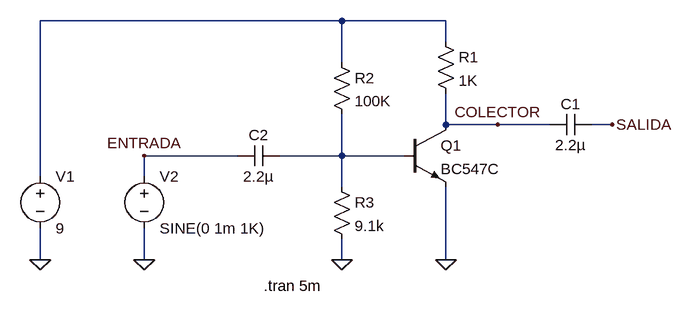
[diagram p0: schematic transistor-amplificador-1-etapa.asc]
transistor-amplificador-1-etapa.asc, the LTspice schematic file:
Version 4
SHEET 1 880 680
WIRE 208 -64 -256 -64
WIRE 368 -64 208 -64
WIRE 368 -32 368 -64
WIRE 208 0 208 -64
WIRE 368 96 368 48
WIRE 448 96 368 96
WIRE 528 96 448 96
WIRE 624 96 592 96
WIRE 48 144 -96 144
WIRE 208 144 208 80
WIRE 208 144 112 144
WIRE 304 144 208 144
WIRE -256 176 -256 -64
WIRE -96 176 -96 144
WIRE 208 192 208 144
WIRE -256 304 -256 256
WIRE -96 304 -96 256
WIRE 208 304 208 272
WIRE 368 304 368 192
FLAG -96 304 0
FLAG 368 304 0
FLAG -256 304 0
FLAG 624 96 SALIDA
FLAG -96 144 ENTRADA
FLAG 208 304 0
FLAG 448 96 COLECTOR
SYMBOL npn 304 96 R0
SYMATTR InstName Q1
SYMATTR Value BC547C
SYMBOL res 352 -48 R0
SYMATTR InstName R1
SYMATTR Value 1K
SYMBOL voltage -256 160 R0
WINDOW 123 0 0 Left 0
WINDOW 39 0 0 Left 0
SYMATTR InstName V1
SYMATTR Value 9
SYMBOL voltage -96 160 R0
WINDOW 123 0 0 Left 0
WINDOW 39 0 0 Left 0
SYMATTR InstName V2
SYMATTR Value SINE(0 1m 1K)
SYMBOL cap 592 80 R90
WINDOW 0 0 32 VBottom 2
WINDOW 3 32 32 VTop 2
SYMATTR InstName C1
SYMATTR Value 2.2µ
SYMBOL cap 112 128 R90
WINDOW 0 0 32 VBottom 2
WINDOW 3 32 32 VTop 2
SYMATTR InstName C2
SYMATTR Value 2.2µ
SYMBOL res 192 -16 R0
SYMATTR InstName R2
SYMATTR Value 100K
SYMBOL res 192 176 R0
SYMATTR InstName R3
SYMATTR Value 9.1k
TEXT 88 344 Left 2 !.tran 5m

The netlist it stands for:
* transistor-amplificador-1-etapa.asc
Q1 COLECTOR N002 0 0 BC547C
R1 N001 COLECTOR 1K
V1 N001 0 9
V2 ENTRADA 0 SINE(0 1m 1K)
C1 SALIDA COLECTOR 2.2µ
C2 N002 ENTRADA 2.2µ
R2 N001 N002 100K
R3 N002 0 9.1k
.model NPN NPN
.model PNP PNP
.lib standard.bjt
.tran 5m
.backanno
.end